# EAGLE design blimprx (EAGLE 5.11)
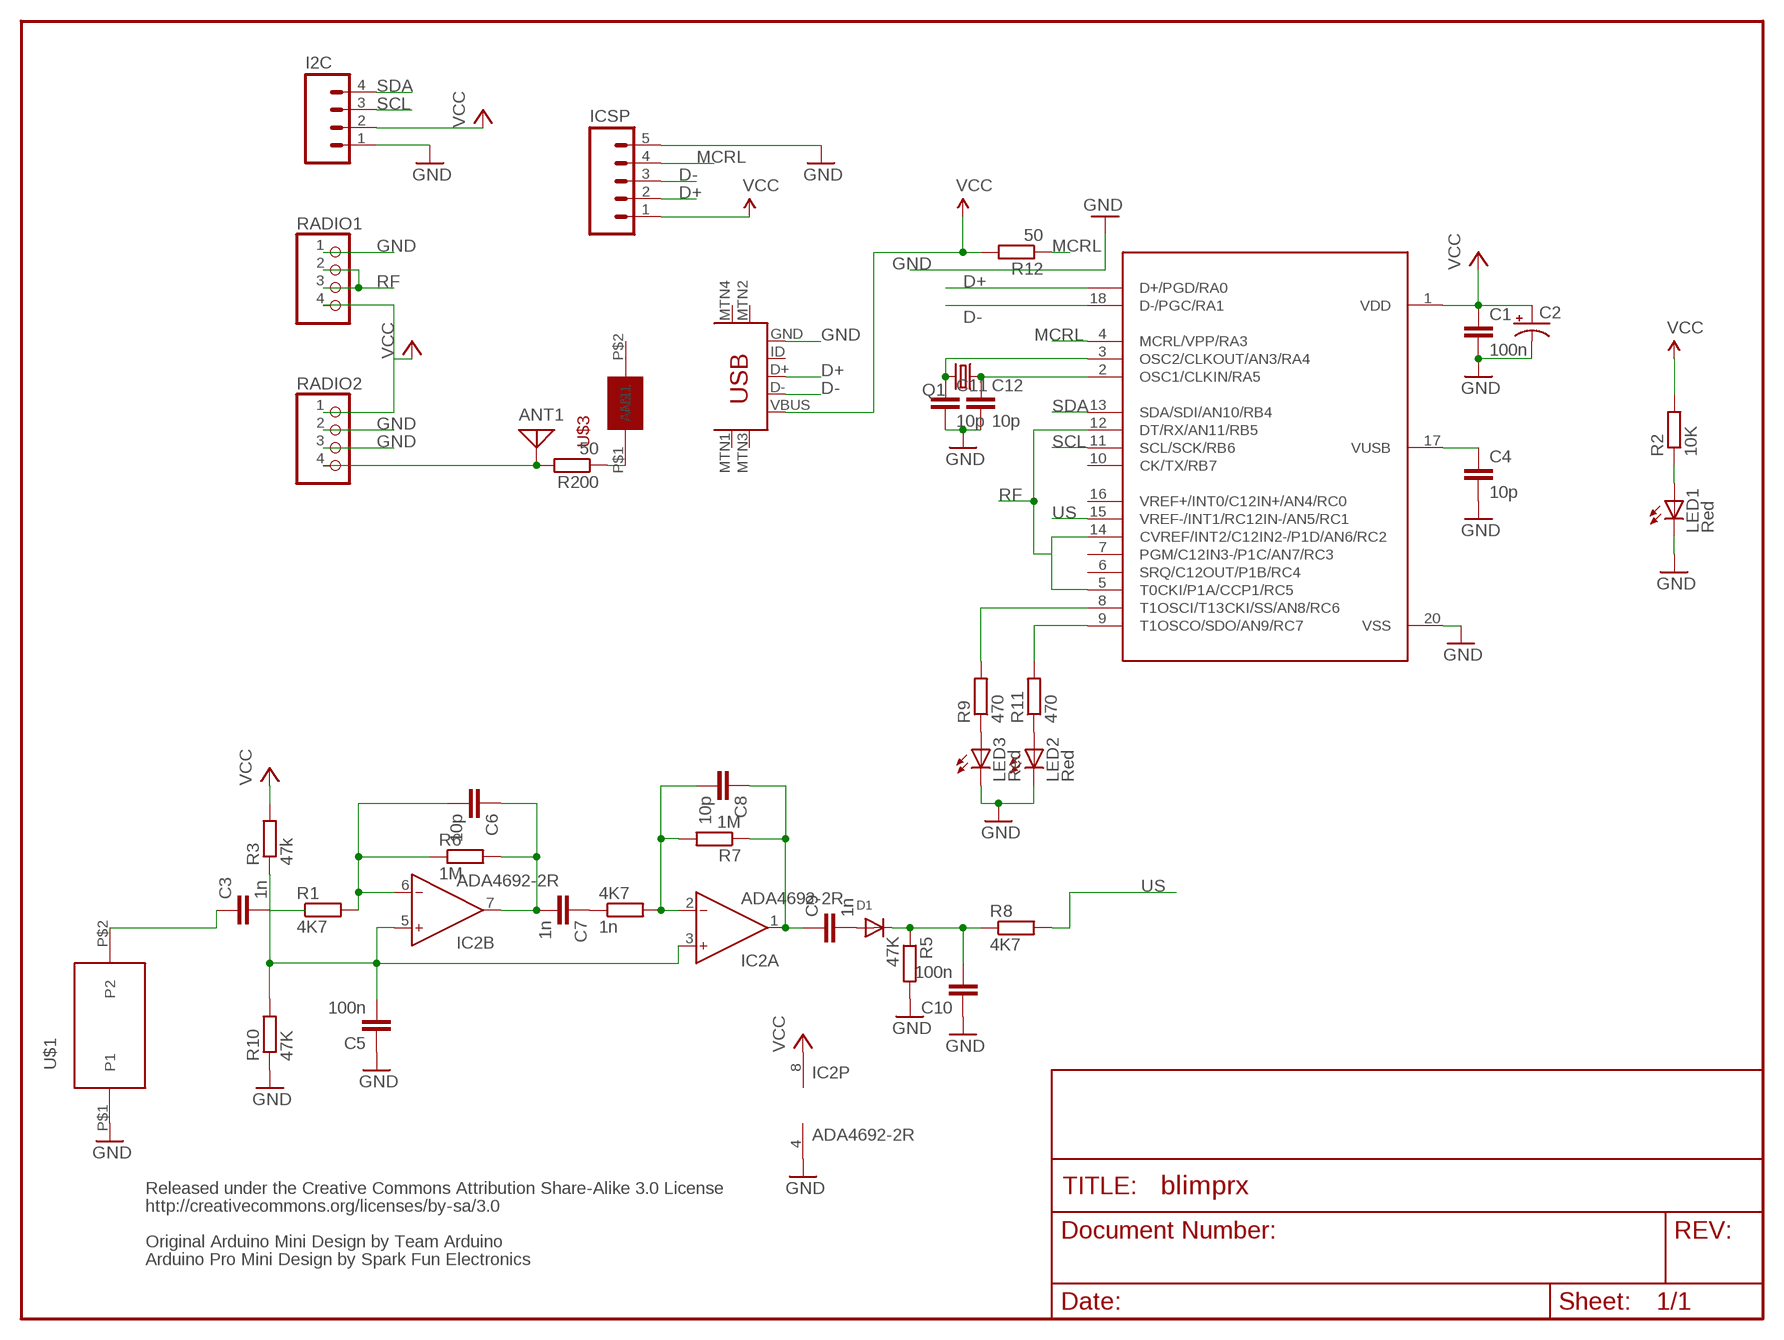
[diagram p0: schematic, sheet 1]

## Parts
4K7  1n  R-EU_R1206  [R1206]
ANT1  ANTENNA  [PAD-01]
C1  100n  C-EUC0805  [C0805]
C2  CAP_POLD  [PANASONIC_D]
C3  1n  C-EUC0805  [C0805]
C4  10p  C-EUC0805  [C0805]
C5  100n  C-EUC0805  [C0805]
C6  10p  C-EUC0805  [C0805]
C7  1n  C-EUC0805  [C0805]
C8  10p  C-EUC0805  [C0805]
C9  1n  C-EUC0805  [C0805]
C10  100n  C-EUC0805  [C0805]
C11  10p  C-EUC0805  [C0805]
C12  10p  C-EUC0805  [C0805]
D1  DIODESOD-123  [SOD-123]
I2C  M04LONGPADS  [1X04_LONGPADS]
IC2  ADA4692-2R  [SO8]
ICSP  M05PTH_LONGPADS  [1X05_LONGPADS]
LED1  Red  LED0603  [LED-0603]
LED2  Red  LED0603  [LED-0603]
LED3  Red  LED0603  [LED-0603]
Q1  CRYSTALHC49UP  [HC49UP]
R1  4K7  R-EU_R1206  [R1206]
R2  10K  R-EU_R1206  [R1206]
R3  47k  R-EU_R1206  [R1206]
R5  47K  R-EU_R1206  [R1206]
R6  1M  R-EU_R1206  [R1206]
R7  1M  R-EU_R1206  [R1206]
R8  4K7  R-EU_R1206  [R1206]
R9  470  R-EU_R1206  [R1206]
R10  47K  R-EU_R1206  [R1206]
R11  470  R-EU_R1206  [R1206]
R12  50  R-EU_R1206  [R1206]
R200  50  R-EU_R1206  [R1206]
RADIO1  PINHD-1X4  [1X04]
RADIO2  PINHD-1X4  [1X04]
U$1  SR400  [SR400-PAK]
U$2  USB-MINIB-5PIN  [USB-MINIB]
U$3  AN433MHZ  [AN433MHZ]
U$4  PIC18F14K50  [SOIC20W]

## Nets
B: IC2.8(P:V+) ; supply symbol labelled VCC
D+: ICSP.2 U$2.D+ U$4.19(D+/PGD/RA0)
D-: ICSP.3 U$2.D- U$4.18(D-/PGC/RA1)
GND [vcc]: C1.2 C2.- C4.2 C5.1 C10.1 C11.2 C12.2 I2C.1 IC2.4(P:V-) ICSP.5 LED1.C LED2.C LED3.C R5.2 R10.1 RADIO1.1 RADIO2.2 RADIO2.3 U$1.P$1(P1) U$2.GND U$4.20(VSS)
MCRL: ICSP.4 R12.1 U$4.4(MCRL/VPP/RA3)
N$1: LED3.A R9.1
N$2: C4.1 U$4.17(VUSB)
N$3: 4K7.1 C7.1
N$4: C3.1 U$1.P$2(P2)
N$5: C3.2 R1.1
N$7: LED2.A R11.1
N$8: C6.1 C7.2 IC2.7(B:OUT) R6.2
N$9: 4K7.2 C8.2 IC2.2(A:IN-) R7.2
N$11: C5.2 IC2.3(A:IN+) IC2.5(B:IN+) R3.1 R10.2
N$12: C10.2 D1.C R5.1 R8.1
N$13: ANT1.1 R200.2 RADIO2.4
N$14: C6.2 IC2.6(B:IN-) R1.2 R6.1
N$15: R9.2 U$4.8(T1OSCI/T13CKI/SS/AN8/RC6)
N$16: C8.1 C9.1 IC2.1(A:OUT) R7.1
N$19: R200.1 U$3.P$1(AN1)
N$20: R11.2 U$4.9(T1OSCO/SDO/AN9/RC7)
N$22: C9.2 D1.A
N$27: C11.1 Q1.2 U$4.3(OSC2/CLKOUT/AN3/RA4)
N$29: C12.1 Q1.1 U$4.2(OSC1/CLKIN/RA5)
N$38: LED1.A R2.1
RF: RADIO1.2 RADIO1.3 U$4.5(T0CKI/P1A/CCP1/RC5) U$4.12(DT/RX/AN11/RB5) U$4.14(CVREF/INT2/C12IN2-/P1D/AN6/RC2)
SCL: I2C.3 U$4.11(SCL/SCK/RB6)
SDA: I2C.4 U$4.13(SDA/SDI/AN10/RB4)
US: R8.2 U$4.15(VREF-/INT1/RC12IN-/AN5/RC1)
VCC: C1.1 C2.+ I2C.2 ICSP.1 R2.2 R3.2 R12.2 RADIO1.4 RADIO2.1 U$2.VBUS U$4.1(VDD)
Unconnected: U$2.ID U$2.MTN1(MTN2) U$2.MTN2(MTN3) U$2.MTN3(MTN1) U$2.MTN4 U$3.P$2(AN2) U$4.6(SRQ/C12OUT/P1B/RC4) U$4.7(PGM/C12IN3-/P1C/AN7/RC3) U$4.10(CK/TX/RB7) U$4.16(VREF+/INT0/C12IN+/AN4/RC0)

## Notes on the sheet
- Released under the Creative Commons Attribution Share-Alike 3.0 License
- http://creativecommons.org/licenses/by-sa/3.0
- Original Arduino Mini Design by Team Arduino
- Arduino Pro Mini Design by Spark Fun Electronics

## Library data of the parts
4K7 R1 R3 R5-R8 R10 = rcl:R-EU_: RESISTOR, European symbol
ANT1 = discrete:ANTENNA: Antenna
C1 C3-C12 = rcl:C-EU: CAPACITOR, European symbol
C2 = SparkFun:CAP_POL: Capacitor Polarized These are standard SMD and PTH capacitors. Normally 10uF, 47uF, and 100uF in electrolytic and tantalum varieties. Always verify the external diameter of the through hole cap, it varies with capacity, voltage, and manufacturer. The EIA devices should be standard.
D1 = adafruit:DIODE: Diode SMADIODE - SMA Surface Mount Package 20V 1A Schottky Diode Digikey: 641-1014-6-ND DO-1N4148 - Through Hole Small Current Diode SOD-123 20V 1 A (.5mV Vf) Schottky Diode - Digikey: MBRX120TPMSCT-ND SOD-323 10V 570mA (.38mV Vf, 3ns) Schottky Diode - Digikey: ZLLS410CT-ND SOD-523 30V 30mA Schottky Diode (RB751S-40TE61) - Digikey: RB751S-40TE61CT-ND SOT23-R/W - SOT23 Package (R = Solder Paste/Reflow Ovens, W = Hand-Soldering) BAT54Film 40V 300mA - Digikey: 497-7162-1-ND
I2C = SparkFun:M04: Header 4 Standard 4-pin 0.1" header. Use with straight break away headers (SKU : PRT-00116), right angle break away headers (PRT-00553), swiss pins (PRT-00743), machine pins (PRT-00117), and female headers (PRT-00115). Molex polarized connector foot print use with SKU : PRT-08231 with associated crimp pins and housings. 1MM SMD Version SKU: PRT-10208
IC2 = analog-devices:ADA4692-2: Low Power, 3.6 MHz, Low Noise, Rail-to-Rail Output, Operational Amplifiers Source: http://www.analog.com/static/imported-files/data_sheets/ADA4691-2_4692-2_4692-4.pdf
ICSP = SparkFun:M05: Header 5 Standard 5-pin 0.1" header. Use with straight break away headers (SKU : PRT-00116), right angle break away headers (PRT-00553), swiss pins (PRT-00743), machine pins (PRT-00117), and female headers (PRT-00115). Molex polarized connector foot print use with SKU : PRT-08230 with associated crimp pins and housings.
LED1-LED3 = SparkFun:LED: LEDs Standard schematic elements and footprints for 5mm, 3mm, 1206, and 0603 sized LEDs. 5mm - Spark Fun Electronics SKU : COM-00529 (and others)
Q1 = crystal:CRYSTAL: CRYSTAL
R2 R9 R11 R12 R200 = resistor:R-EU_: RESISTOR, European symbol
RADIO1 RADIO2 = pinhead:PINHD-1X4: PIN HEADER
U$1 = blimp:SR400: Ultraosund sensor
U$2 = SparkFun:USB-MINIB: Mini-USB "B" connector with 5th pin broken out. Created new symbol breaking out 5th "ID" pin in mini/micro USB connector spec. See: http://en.wikipedia.org/wiki/Mini_usb#Cables. Uses same footprint as 4-pin symbol. Also added pins to connect to mounting / shield pads if required (probably not generally needed as signals aren't shielded once they leave the connector).
U$3 = blimp:AN433MHZ
U$4 = blimp:PIC18F14K50

## Net classes
0 default: width 0.203 mm
1 vcc: width 0.254 mm

## Board
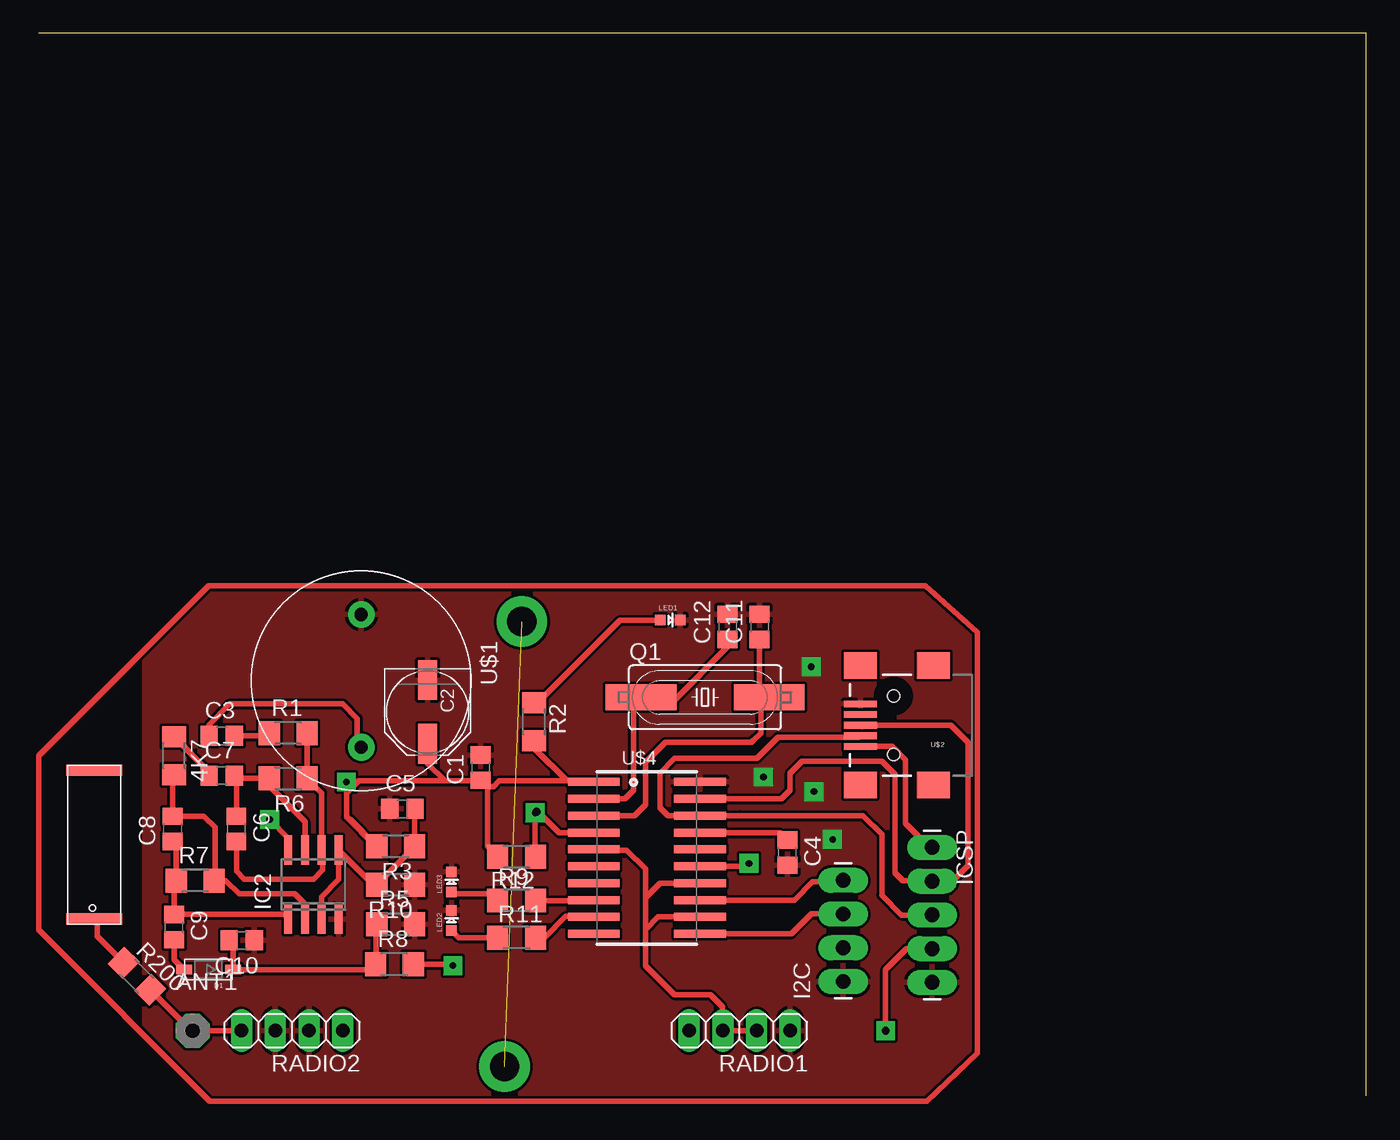
[diagram p1: board, top side]
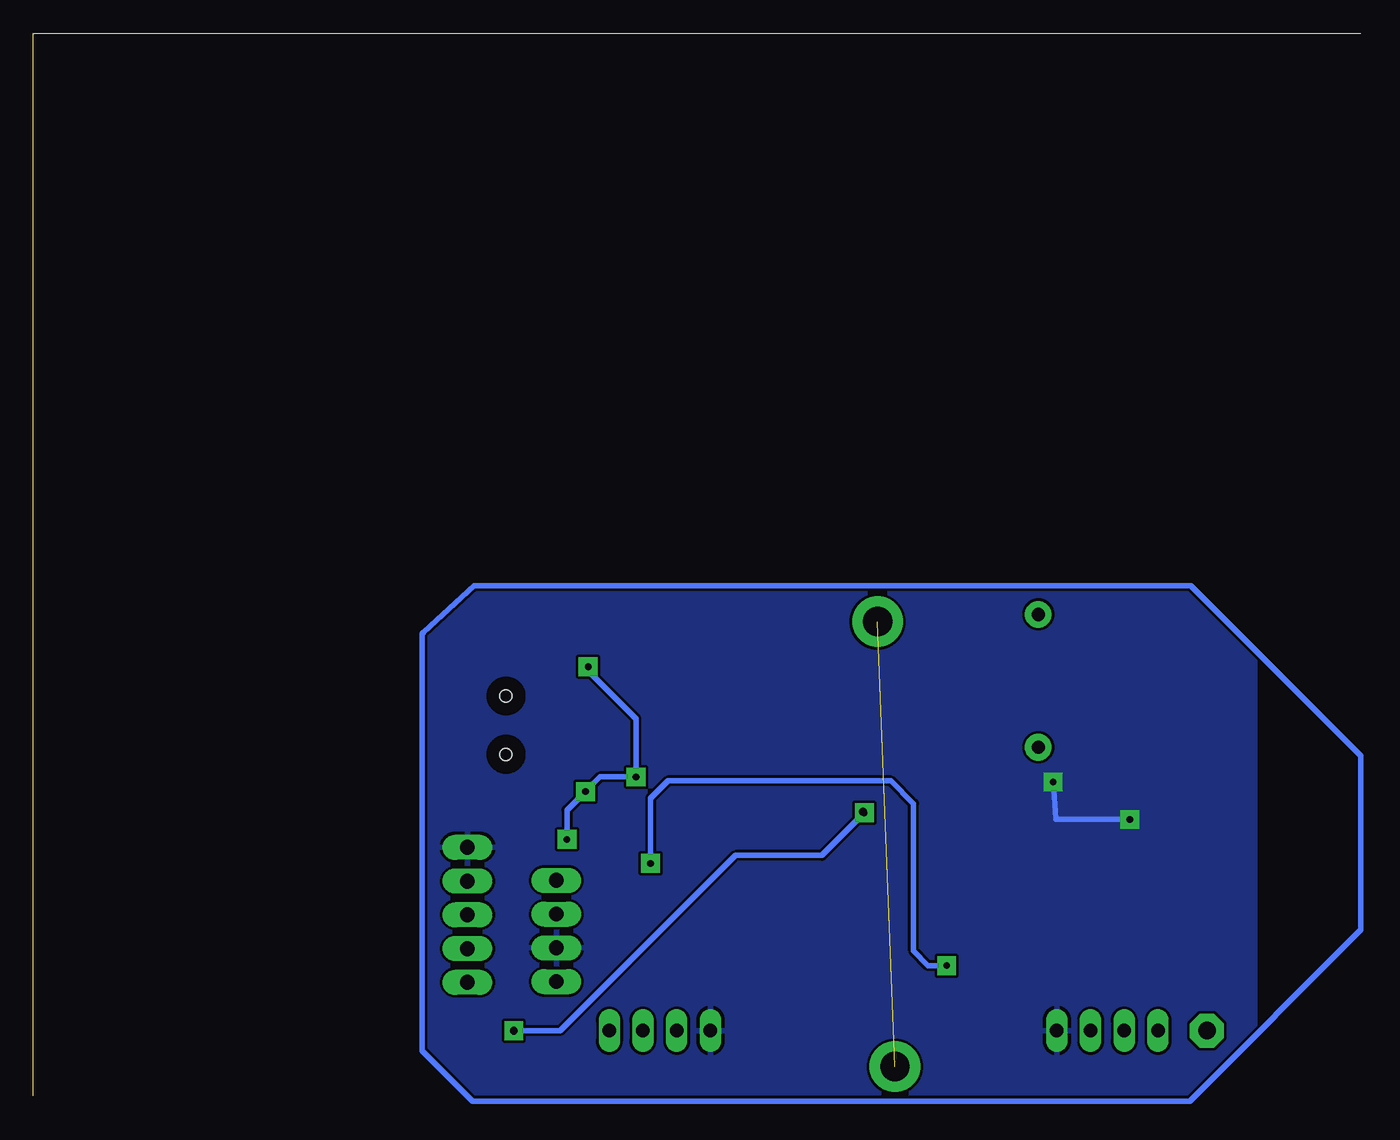
[diagram p2: board, bottom side, seen from below]

Size 100 x 80 mm. Coordinates in mm from the lower left corner, seen from the top.
Outline: 100,0 100,80 0,80
Copper layers (1*16): Top 0.035mm / dielectric 1.5mm / Bottom 0.035mm
Design rules "default *": minimum track width 10mil, minimum drill 24mil, track to track 8mil, track to pad 8mil, pad to pad 8mil, via to via 8mil, smd to smd 8mil, copper to edge 40mil, drill to drill 8mil, minimum pad ring 12mil, minimum via ring 8mil, stop-mask expansion 4mil, vias tented up to drill 0mil, thermal gap 10mil

### Footprints (pad centres in the part's own frame; a part is rotated, then mirrored left to right if it is on the bottom)
R1206 = smd 1.6 x 1.803: 1 -1.422,0; 2 1.422,0
PAD-01 = drill 1.321 pad 2.54 octagon: 1 0,0
C0805 = smd 1.3 x 1.5: 1 -0.95,0; 2 0.95,0
PANASONIC_D = smd 3 x 1.4: + 2.4,0; - -2.4,0
SOD-123 = smd 1.2 x 0.7: A 1.85,0; C -1.85,0
1X04_LONGPADS = drill 1.118 pad 1.88 long: 1 0,0; 2 2.54,0; 3 5.08,0; 4 7.62,0
SO8 = smd 0.6 x 2.2: 1 -1.905,-2.6; 2 -0.635,-2.6; 3 0.635,-2.6; 4 1.905,-2.6; 5 1.905,2.6; 6 0.635,2.6; 7 -0.635,2.6; 8 -1.905,2.6
1X05_LONGPADS = drill 1.118 pad 1.88 long: 1 0,0; 2 2.54,0; 3 5.08,0; 4 7.62,0; 5 10.16,0
LED-0603 = smd 0.8 x 0.8: A 0,-0.75; C 0,0.75
HC49UP = smd 5.334 x 1.93: 1 -4.826,0; 2 4.826,0
1X04 = drill 1.016 long: 1 -3.81,0; 2 -1.27,0; 3 1.27,0; 4 3.81,0
SR400-PAK = drill 1 pad 2 round: P$1 0,0; P$2 10,0
USB-MINIB = smd 2.5 x 0.5: D+ 2.5,0; D- 2.5,0.8; GND 2.5,-1.6; ID 2.5,-0.8; VBUS 2.5,1.6 | smd 2.5 x 2: MTN1 -3,4.5; MTN2 2.5,4.5; MTN3 -3,-4.5; MTN4 2.5,-4.5 | hole 0.9: 0,2.2; 0,-2.2
AN433MHZ = smd 0.85 x 4.2: P$1 0.4,2; P$2 11.6,2
SOIC20W = smd 0.6 x 3.9: 1 3.175,-0.19; 2 4.445,-0.19; 3 5.715,-0.19; 4 6.985,-0.19; 5 8.255,-0.19; 6 9.525,-0.19; 7 10.795,-0.19; 8 12.065,-0.19; 9 13.335,-0.19; 10 14.605,-0.19; 11 14.605,7.81; 12 13.335,7.81; 13 12.065,7.81; 14 10.795,7.81; 15 9.525,7.81; 16 8.255,7.81; 17 6.985,7.81; 18 5.715,7.81; 19 4.445,7.81; 20 3.175,7.81

### Placement (x,y rotation side)
4K7  10.2,25.6 270 top
ANT1  11.6,4.9 0 top
C1  33.3,24.7 90 top
C2  29.3,28.9 270 top
C3  13.8,27.1 0 top
C4  56.4,18.3 270 top
C5  27.4,21.6 0 top
C6  14.9,20.1 270 top
C7  13.8,24.1 0 top
C8  10.1,20.1 90 top
C9  10.2,12.7 270 top
C10  15.3,11.7 180 top
C11  54.3,35.3 90 top
C12  51.9,35.3 90 top
D1  12.8,9.5 180 top
I2C  60.6,8.6 90 top
IC2  20.7,15.9 0 top
ICSP  67.3,18.7 270 top
LED1  47.57,35.82 270 top
LED2  31.1,13.2 0 top
LED3  31.1,16.1 0 top
Q1  50.2,30 0 top
R1  18.8,27.3 0 top
R2  37.32,28.16 270 top
R3  26.9,18.8 180 top
R5  26.9,12.9 0 top
R6  18.8,23.9 180 top
R7  11.8,16.2 0 top
R8  26.8,9.9 0 top
R9  36,14.7 0 top
R10  26.9,15.9 180 top
R11  36,11.9 0 top
R12  36,18 180 top
R200  7.4,9 315 top
RADIO1  52.8,4.9 180 top
RADIO2  19.1,4.9 180 top
U$1  24.3,36.24 270 top
U$2  64.4,27.9 180 top
U$3  6.2,12.9 90 top
U$4  42,26.8 270 top

### Tracks (layer width: path | path; a pad name or v marks a point on that pad's centre or on a via)
B
  Top 0.406: IC2.8 18.8,19.41 17.4,20.8
D+
  Top 0.406: ICSP.2 67.24,16.1 | 62,27.8 U$2.D+ 68.7,27.9 70,26.6 70,17.3 68.8,16.1 67.36,16.1 ICSP.2 | U$4.19 55.95,22.36 56.6,23 56.6,24.3 57.5,25.2 63.5,25.2 64.5,24.2 64.5,16.8 65.1,16.2 67.26,16.2 ICSP.2
D-
  Top 0.406: U$4.18 52.83,21.1 62.1,21.1 63.5,19.7 63.5,15.1 65,13.6 67.28,13.6 ICSP.3 | U$4.18 50.81,21.09 | U$2.D- 61.8,27 55.7,27 54.1,25.4 47.9,25.4 46.8,24.3 46.8,21.7 47.4,21.1 49.8,21.1 U$4.18
GND  (via drill 0.5 pad 1.42)
  Bottom 0.406: v58.2,32.3 58.2,32 54.6,28.4 v54.6,24 57.3,24 v58.4,22.9 59.8,21.5 v59.8,19.3
  pour Top: 8,37.4 8,41.6 72,41.6 72,-2.7 8,-2.7 8,37.3
MCRL  (via drill 0.5 pad 1.42, 0.6)
  Top 0.406: v37.4,21.3 37.4,18.02 R12.1 | v37.5,21.4 37.6,21.4 39.2,19.8 41.8,19.8 U$4.4 | ICSP.4 65.38,11.08 63.8,9.5 v63.8,4.9
  Bottom 0.406: v37.5,21.4 v37.4,21.3 40.6,18.1 47.1,18.1 60.3,4.9 v63.8,4.9
N$1
  Top 0.406: R9.1 34.08,15.2 31.25,15.2 LED3.A
N$2
  Top 0.406: U$4.17 52.83,19.8 55.85,19.8 C4.1
N$3
  Top 0.406: C7.1 12.85,24.37 4K7.1
N$4
  Top 0.406: C3.1 12.85,27.95 14.4,29.5 22.9,29.5 24,28.4 24,26.54 U$1.P$2
N$5
  Top 0.406: C3.2 17.18,27.1 R1.1
N$7
  Top 0.406: R11.1 31.65,11.9 LED2.A
N$8
  Top 0.406: IC2.7 20.07,20.64 17.4,23.3 17.4,23.88 R6.2 14.95,23.9 C7.2 14.9,23.95 C6.1
N$9
  Top 0.406: 4K7.2 10.1,24.08 C8.2 12.45,21.05 13.3,20.2 13.3,16.28 R7.2 | R7.2 14.1,16.2 15.1,15.2 19.3,15.2 20,14.5 20,13.37 IC2.2 | R7.2 13.2,16.22
N$11
  Top 0.406: IC2.3 21.3,13.34 21.3,15 22.61,16.3 IC2.5 25.2,15.9 R10.2 28.32,18.74 R3.1 28.32,21.57 C5.2
N$12
  Top 0.406: R5.1 R8.1 24.98,9.5 D1.C 14.65,11.4 C10.2
N$13
  Top 0.406: RADIO2.4 ANT1.1 11,5.5 10.9,5.5 R200.2
N$14
  Top 0.406: R1.2 R6.1 21.34,22.79 IC2.6 21.4,18.43 21.4,17 20.7,16.3 15.5,16.3 14.9,16.9 C6.2
N$15
  Top 0.406: R9.2 41.77,14.7 U$4.8
N$16
  Top 0.406: IC2.1 18.45,13.65 C9.1 10.2,16.02 R7.1 10.38,18.87 C8.1
N$19
  Top 0.406: U$3.P$1 4.3,13.3 4.4,13.2 | 4.4,13.2 4,13.2 3.8,13.4 | 4.4,13.2 4.4,12 R200.1
N$20
  Top 0.406: R11.2 38.1,11.9 39.7,13.5 41.77,13.5 U$4.9
N$21
  Top 0.406: 66.8,38.4 70.7,34.9 70.7,3.2 66.9,-0.4 12.9,-0.4 0,12.5 0,25.6 12.8,38.4 66.8,38.4
N$22
  Top 0.406: C9.2 10.2,10.25 D1.A
N$24
  Bottom 0.406: 0,25.6 12.8,38.4 66.8,38.4 70.6,34.9 70.7,34.8 70.7,3.4 66.9,-0.4 12.9,-0.4 0,12.5 0,25.6
N$26  (via drill 2.2 pad 3.81)  (1 unrouted)
  other vias: 36.4,35.7 35.1,2.2
N$27
  Top 0.406: 53.9,29.8 54.83,29.8 Q1.2 | Q1.2 54.4,29.37 54.4,27.3 53.85,26.75 53.7,26.6 47.2,26.6 45.7,25.1 45.7,21.9 44.88,21.09 U$4.3 | Q1.2 54.8,30 54.3,30.5 C11.1
N$29
  Top 0.406: Q1.1 45.7,29.67 47.77,29.67 51.9,33.8 C12.1 | U$4.2 44.16,22.36 44.8,23 44.8,29.4 45.37,29.97 Q1.1 | Q1.1 45.17,29.8 44.4,29.8 44.6,30 44.7,30 44.4,30.3 44.4,30.4 44.6,30.4 44.7,30.5
N$38
  Top 0.406: R2.1 37.58,29.58 43.8,35.8 46.8,35.8 LED1.A
RF
  Top 0.406: RADIO1.2 RADIO1.3 51.5,4.93 51.5,6.7 50.6,7.6 47.9,7.6 45.7,9.8 45.7,12.5 | 49.74,13.4 U$4.12 46.66,13.46 45.7,12.5 | U$4.5 41.85,18.5 44.3,18.5 45.7,17.1 45.7,14.9 | 45.7,12.5 45.7,14.9 | U$4.14 46.8,16 45.7,14.9
SCL
  Top 0.406: U$4.11 56.7,12.2 58.2,13.7 60.58,13.7 I2C.3
SDA
  Top 0.406: U$4.13 56.94,14.73 58.3,16.1 60.48,16.1 I2C.4
US  (via drill 0.5 pad 1.42)
  Top 0.406: R8.2 31.1,9.9 v31.2,9.8 | U$4.15 53.27,17.27 v53.5,17.5
  Bottom 0.406: v53.5,17.5 53.5,22.4 52.2,23.7 35.4,23.7 33.7,22 33.7,10.9 32.6,9.8 v31.2,9.8
VCC  (via drill 0.5 pad 1.42)
  Top 0.406: 23.46,20.82 R3.2 25.4,18.8 23.2,21 23.2,22.8 23.55,23.15 | C1.1 33.8,23.25 | 23.55,23.15 24.1,23.7 30.6,23.7 | C1.1 33.1,23.55 32.95,23.55 32.8,23.7 | 33.8,23.25 33.8,18.78 R12.2 | 33.8,23.25 34.25,23.25 34.7,23.7 39.8,23.7 | 39.8,23.7 41.73,23.7 U$4.1 40.88,23.62 | v23.18,23.62 23.18,23.52 23.55,23.15 | R2.2 37.32,26.18 39.8,23.7 | ICSP.1 67.1,18.7 65.3,20.5 65.3,25.3 64.3,26.3 U$2.VBUS | 32.8,23.7 33.25,23.7 C1.1 | 30.6,23.7 32.8,23.7 | 30.6,23.7 29.3,25 C2.+
  Bottom 0.406: v17.4,20.8 22.98,20.8 v23.18,23.62
  pour Bottom: 8,40.2 8,-2.7 72,-2.7 72,41.6 8,41.6